# EAGLE design Adapter-Stamps-005 (EAGLE 7.3.0)
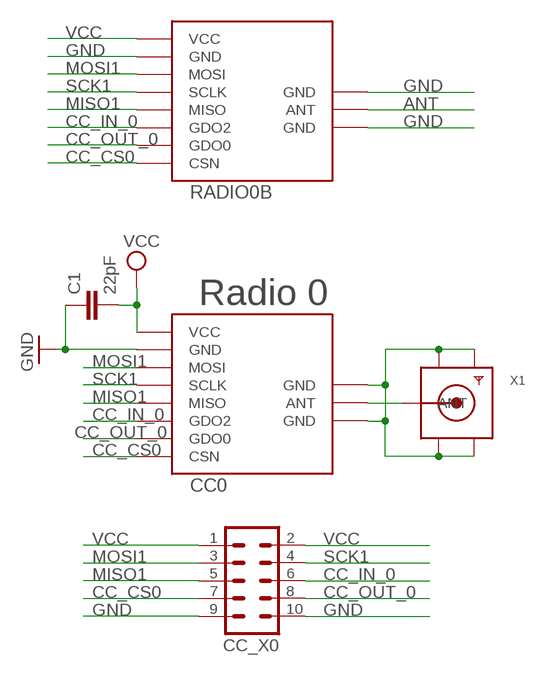
[diagram p0: schematic, sheet 1]

## Parts
C1  22pF  C-EUC0805  [C0805]
CC0  CC1101_MODULE1SMD  [CC1101_MODULE1_SMD]
CC_X0  MA05-2  [MA05-2]
RADIO0B  CC1101_MODULE1SMALL  [CC1101_MODULE1_SMD]
X1  SMACONNECTOR_EDGE_UFL  [SMA_EDGELAUNCH_UFL]

## Nets
ANT: RADIO0B.ANT
CC_CS0: CC0.CSN CC_X0.7 RADIO0B.CSN
CC_IN_0: CC0.GDO2 CC_X0.6 RADIO0B.GDO2
CC_OUT_0: CC0.GDO0 CC_X0.8 RADIO0B.GDO0
GND: C1.1 CC0.GND@0(GND) CC_X0.9 CC_X0.10 RADIO0B.GND@0(GND) RADIO0B.GND@1(GND) RADIO0B.GND@2(GND)
MISO1: CC0.MISO CC_X0.5 RADIO0B.MISO
MOSI1: CC0.MOSI CC_X0.3 RADIO0B.MOSI
N$1: CC0.ANT X1.P(ANT)
N$3: CC0.GND@1(GND) CC0.GND@2(GND) X1.GND@1(GND1) X1.GND@2(GND2) X1.GND@3(GND3) X1.GND@4(GND4)
SCK1: CC0.SCLK CC_X0.4 RADIO0B.SCLK
VCC: C1.2 CC0.VCC CC_X0.1 CC_X0.2 RADIO0B.VCC

## Notes on the sheet
- Radio 0

## Library data of the parts
C1 = rcl:C-EU: CAPACITOR, European symbol
CC0 = wireless:CC1101_MODULE1: CC1101 wireless module for 433/868 MHz (sold from Aliexpress). DIL version for mounting with pin header (and SMD soldering) and SMD only variant available.
CC_X0 = con-lstb:MA05-2: PIN HEADER; OC_FARNELL: unknown; OC_NEWARK: unknown
RADIO0B = Martin-Communication:CC1101_MODULE1: CC1101 wireless module for 433/868 MHz (sold from Aliexpress). DIL version for mounting with pin header (and SMD soldering) and SMD only variant available.
X1 = adafruit:SMACONNECTOR: SMA Connector 90° DIP SMA Connector, 50 Ohm (4UConnector: 07259)

## Net classes
0 default: width 0.406 mm
1 PWR: width 0.305 mm

## Board
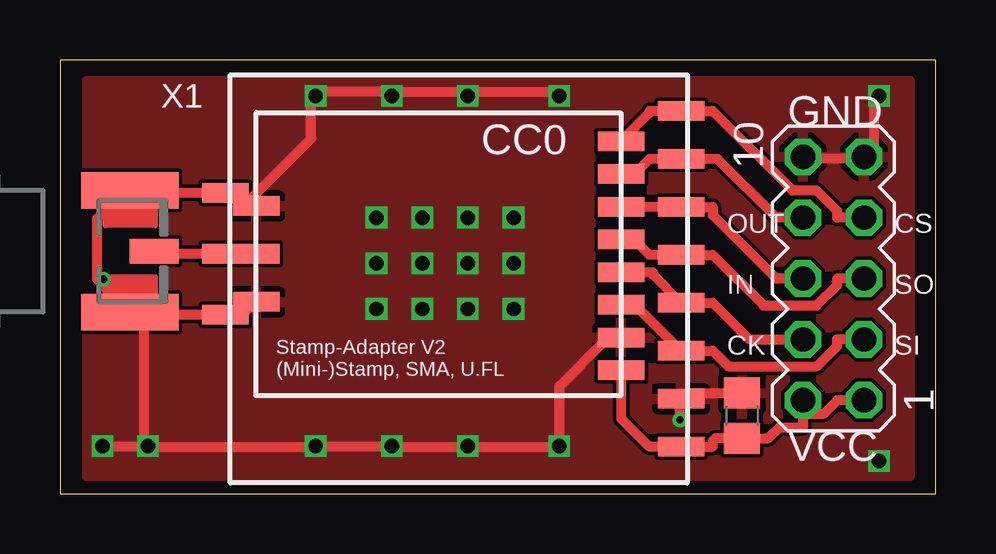
[diagram p1: board, top side]
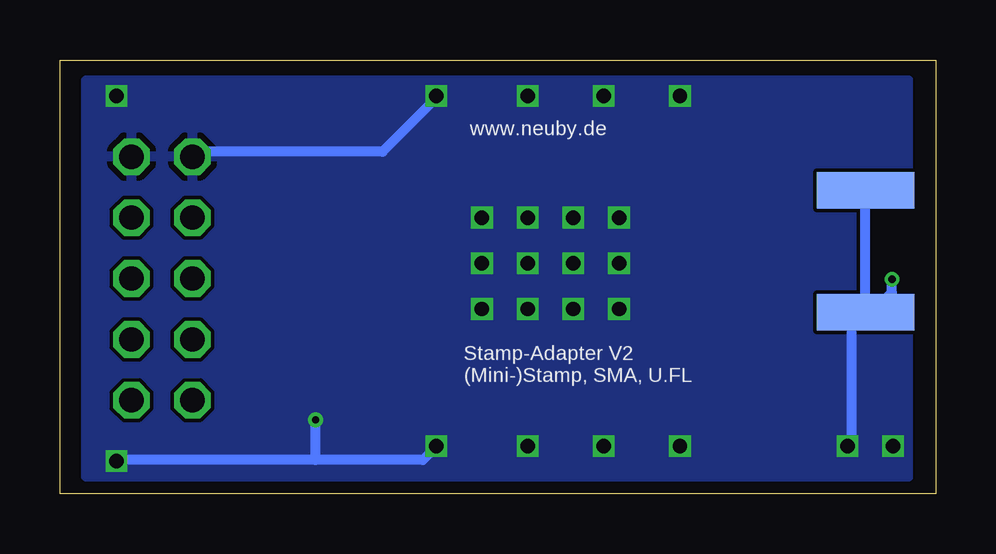
[diagram p2: board, bottom side, seen from below]

Size 36.5 x 18.09 mm. Coordinates in mm from the lower left corner, seen from the top.
Outline: 0,18.09 0,0 36.5,0 36.5,18.09 0,18.09
Copper layers (1*16): Top 0.035mm / dielectric 1.5mm / Bottom 0.035mm
Design rules "SeeedStudio_2layer_DRU_no_angle_20140221": minimum track width 6mil, minimum drill 12mil, track to track 6mil, track to pad 6mil, pad to pad 6mil, via to via 6mil, smd to smd 0mil, copper to edge 10mil, drill to drill 10mil, minimum pad ring 10mil, minimum via ring 6mil, stop-mask expansion 2mil, vias tented up to drill 100mil, thermal gap 10mil

### Footprints (pad centres in the part's own frame; a part is rotated, then mirrored left to right if it is on the bottom)
C0805 = smd 1.3 x 1.5: 1 -0.95,0; 2 0.95,0
CC1101_MODULE1_SMD = smd 1.93 x 0.813: ANT 19,5.96; CSN 0,0; GDO0 0,2; GDO2 0,4; GND@0 0,12; GND@1 19,8.5; GND@2 19,3.42; MISO 0,6; MOSI 0,10; SCLK 0,8; VCC 0,14
MA05-2 = drill 1.016 octagon: 1 -5.08,-1.27; 2 -5.08,1.27; 3 -2.54,-1.27; 4 -2.54,1.27; 5 0,-1.27; 6 0,1.27; 7 2.54,-1.27; 8 2.54,1.27; 9 5.08,-1.27; 10 5.08,1.27
CC1101_MODULE1_SMD' = smd 1.93 x 0.813: ANT 14.889,4.381; CSN -0.318,-0.318; GDO0 -0.318,1.048; GDO2 -0.318,2.413; GND@0 -0.318,7.872; GND@1 14.889,6.381; GND@2 14.889,2.381; MISO -0.318,3.777; MOSI -0.318,6.508; SCLK -0.318,5.143; VCC -0.318,9.238
SMA_EDGELAUNCH_UFL = smd 4.064 x 1.524: GND@1 2.032,-2.54; GND@2 2.032,2.54 | smd 4.064 x 1.524 bottom: GND@3 2.032,2.54; GND@4 2.032,-2.54 | smd 2.032 x 1.016: P 3.048,0

### Placement (x,y rotation side)
C1  28.43,3.26 270 top
CC0  25.89,15.96 180 top
CC_X0  32.24,8.97 90 top
RADIO0B  CC1101_MODULE1SMALL  [CC1101_MODULE1_SMD']  23.08,14.39 180 top
X1  0.88,10.12 0 top

### Tracks (layer width: path | path; a pad name or v marks a point on that pad's centre or on a via)
ANT
  Top 0.406: RADIO0B.ANT 6.9,10
CC_CS0
  Top 0.406: RADIO0B.CSN 24.57,15.88 24.57,15.96 CC0.CSN 27.22,15.96 30.54,12.63 31.56,12.63 32.4,11.79 32.4,11.51 CC_X0.7
CC_IN_0
  Top 0.406: RADIO0B.GDO2 24.56,11.97 24.57,11.96 CC0.GDO2 27.22,11.96 27.22,11.62 29.86,8.97 CC_X0.6
CC_OUT_0
  Top 0.406: RADIO0B.GDO0 23.95,13.34 24.57,13.96 CC0.GDO0 27.41,13.96 29.86,11.51 CC_X0.8
GND  (via drill 0.3, 0.6)
  Top 0.406: C1.1 28.36,4.2 26.12,4.2 CC0.GND@0 25.84,3.92 v25.84,3.08 | 13.83,1.97 10.76,1.97 v10.65,1.99 10.48,1.97 3.77,1.97 v3.67,1.99 | 13.83,1.97 v13.83,1.99 13.83,1.97 | 13.83,1.97 16.9,1.97 v17,1.99 17.18,1.97 20.81,1.97 v20.81,1.99 20.81,2.24 20.81,4.48 22.77,6.44 23.33,6.44 RADIO0B.GND@0 | 7.12,7.55 7.68,7.55 7.96,7.83 RADIO0B.GND@1 | v1.77,1.99 1.82,1.97 3.49,1.97 v3.67,1.99 | 3.49,6.71 3.49,2.24 v3.67,1.99 | v34.15,16.59 33.95,16.49 33.95,14.54 33.67,14.26 CC_X0.9 33.39,13.98 31.15,13.98 CC_X0.10 | 13.83,16.77 10.76,16.77 v10.65,16.59 10.48,16.49 10.48,14.82 7.96,12.3 RADIO0B.GND@2 7.96,12.02 7.68,12.3 7.12,12.3 | 13.83,16.77 v13.83,16.59 13.83,16.77 | 13.83,16.77 16.9,16.77 v17,16.59 17.18,16.77 20.81,16.77 v20.81,16.59
  Bottom 0.406: 25.84,1.41 21.37,1.41 20.81,1.97 v20.81,1.99 | 25.84,1.41 33.95,1.41 v34.15,1.35 | 25.84,1.41 v25.84,3.08 | 3.49,6.71 3.49,2.24 v3.67,1.99 | CC_X0.10 30.87,14.26 23.05,14.26 20.81,16.49 v20.81,16.59
  other vias: 13.2,11.51 13.2,9.61 13.2,7.71 15.1,7.71 17,7.71 18.91,7.71 18.91,9.61 17,9.61 15.1,9.61 15.1,11.51 17,11.51 18.91,11.51
  pour Bottom: 1.13,17.23 34.78,17.23 35.42,17.23 35.42,0.72 1.13,0.72
  pour Top: 1.13,17.23 35.42,17.23 35.42,0.72 1.13,0.72
MISO1
  Top 0.406: RADIO0B.MISO 23.93,10.61 24.57,9.96 CC0.MISO 27.22,9.96 29.33,7.84 31.54,7.84 32.4,8.7 32.4,8.97 CC_X0.5
MOSI1
  Top 0.406: CC_X0.3 32.4,6.44 32.4,6.16 31.55,5.32 27.86,5.32 27.22,5.96 CC0.MOSI 23.98,7.88 RADIO0B.MOSI
N$1
  Top 0.406: CC0.ANT 3.92,10 X1.P
N$3  (via drill 0.3)
  Top 0.406: 1.68,8.81 1.54,8.95 1.54,11.46 2.31,12.24 | 1.68,8.81 2.65,7.83 X1.GND@1 2.91,7.46 CC0.GND@1 | 2.31,12.24 2.65,12.58 X1.GND@2 | v1.82,8.95 1.68,8.81 | CC0.GND@2 3.92,12.54 3.92,12.66 2.31,12.66 2.31,12.24
  Bottom 0.406: v1.82,8.95 1.82,8.39 2.65,7.55 X1.GND@1 2.93,7.83 2.93,12.58 X1.GND@2
SCK1
  Top 0.406: CC_X0.4 28.74,6.44 27.22,7.96 CC0.SCLK 24.71,9.14 24.71,9.24 RADIO0B.SCLK
VCC
  Top 0.406: RADIO0B.VCC 23.39,3.14 24.57,1.96 CC0.VCC 27.22,1.96 27.22,2.2 27.33,2.31 27.88,2.31 C1.2 29.54,2.31 30.01,2.78 30.97,2.78 30.97,3.34 | CC_X0.1 32.4,3.9 31.84,3.34 30.97,3.34 | CC_X0.2 30.97,3.34

### Text on the board
tNames: GND | OUT | CS | IN | SO | CK | SI | Stamp-Adapter V2 / (Mini-)Stamp, SMA, U.FL | VCC
bNames: www.neuby.de | Stamp-Adapter V2 / (Mini-)Stamp, SMA, U.FL